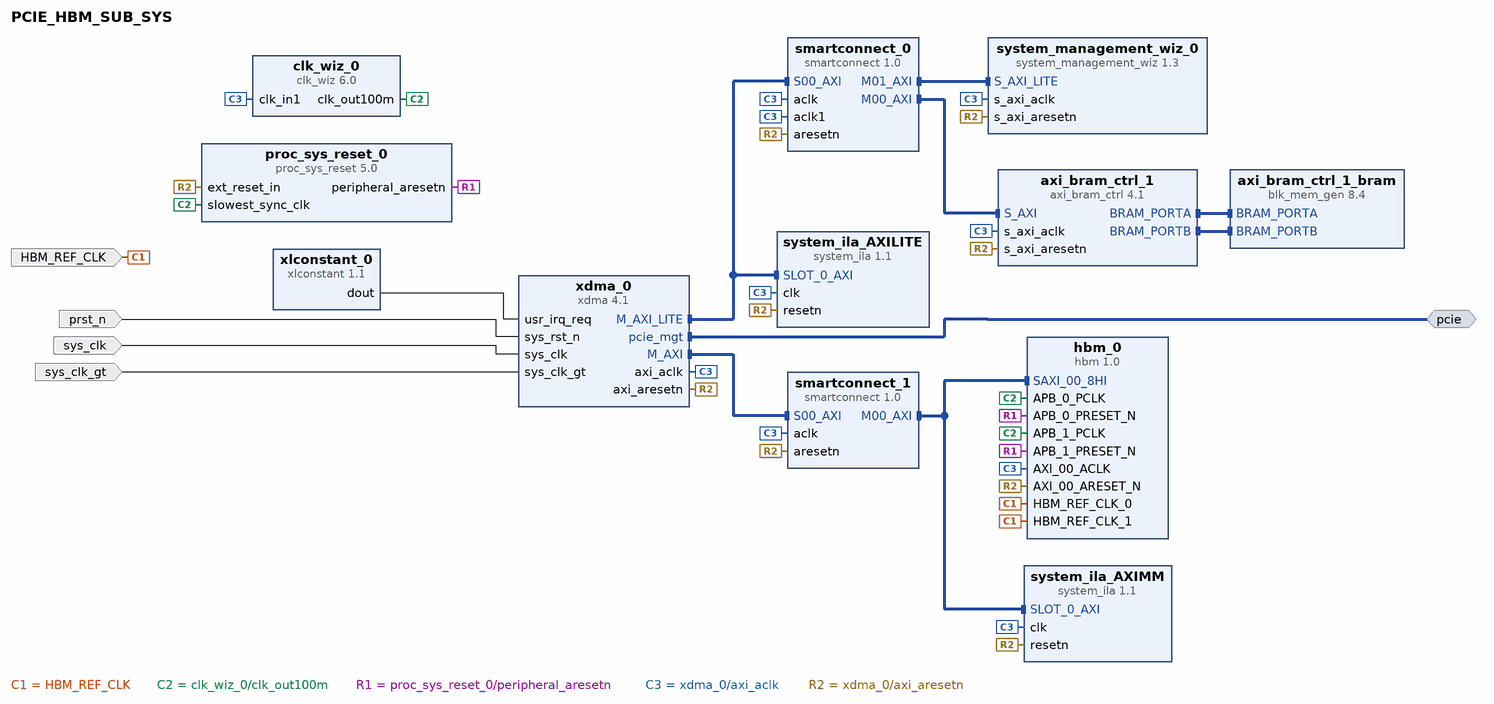
[diagram p0: block diagram of the top level]
# Vivado block design PCIE_HBM_SUB_SYS, xcu55c-fsvh2892-2L-e, Vivado 2021.2
create_bd_design PCIE_HBM_SUB_SYS

create_bd_intf_port -mode Master -vlnv xilinx.com:interface:pcie_7x_mgt_rtl:1.0 pcie
create_bd_port -dir I -type rst prst_n
set_property -dict {CONFIG.POLARITY ACTIVE_LOW} [get_bd_ports prst_n]
create_bd_port -dir I -type clk sys_clk
create_bd_port -dir I -type clk sys_clk_gt
create_bd_port -dir I -type clk HBM_REF_CLK

create_bd_cell -type ip -vlnv xilinx.com:ip:xdma:4.1 xdma_0
set_property -dict [list \
  CONFIG.PF0_DEVICE_ID_mqdma 9048 \
  CONFIG.PF0_SRIOV_VF_DEVICE_ID A048 \
  CONFIG.PF2_DEVICE_ID_mqdma 9248 \
  CONFIG.PF3_DEVICE_ID_mqdma 9348 \
  CONFIG.axi_data_width 512_bit \
  CONFIG.axilite_master_en true \
  CONFIG.axilite_master_size 4 \
  CONFIG.axisten_freq 250 \
  CONFIG.cfg_mgmt_if false \
  CONFIG.mode_selection Advanced \
  CONFIG.pf0_device_id 9048 \
  CONFIG.pl_link_cap_max_link_speed 16.0_GT/s \
  CONFIG.pl_link_cap_max_link_width X8 \
] [get_bd_cells xdma_0]
create_bd_cell -type ip -vlnv xilinx.com:ip:xlconstant:1.1 xlconstant_0
set_property -dict {CONFIG.CONST_VAL 0} [get_bd_cells xlconstant_0]
create_bd_cell -type ip -vlnv xilinx.com:ip:smartconnect:1.0 smartconnect_0
set_property -dict {CONFIG.NUM_CLKS 2 CONFIG.NUM_MI 2 CONFIG.NUM_SI 1} [get_bd_cells smartconnect_0]
create_bd_cell -type ip -vlnv xilinx.com:ip:system_management_wiz:1.3 system_management_wiz_0
set_property -dict {CONFIG.DCLK_FREQUENCY 250.0} [get_bd_cells system_management_wiz_0]
create_bd_cell -type ip -vlnv xilinx.com:ip:axi_bram_ctrl:4.1 axi_bram_ctrl_1
set_property -dict {CONFIG.DATA_WIDTH 512} [get_bd_cells axi_bram_ctrl_1]
create_bd_cell -type ip -vlnv xilinx.com:ip:blk_mem_gen:8.4 axi_bram_ctrl_1_bram
set_property -dict {CONFIG.Memory_Type True_Dual_Port_RAM} [get_bd_cells axi_bram_ctrl_1_bram]
create_bd_cell -type ip -vlnv xilinx.com:ip:system_ila:1.1 system_ila_AXILITE
set_property -dict [list \
  CONFIG.C_INPUT_PIPE_STAGES 1 \
  CONFIG.C_SLOT_0_AXI_R_SEL_TRIG 0 \
  CONFIG.C_SLOT_0_AXI_W_SEL_TRIG 0 \
  CONFIG.C_SLOT_0_TXN_CNTR_EN 0 \
] [get_bd_cells system_ila_AXILITE]
create_bd_cell -type ip -vlnv xilinx.com:ip:system_ila:1.1 system_ila_AXIMM
set_property -dict [list \
  CONFIG.C_INPUT_PIPE_STAGES 1 \
  CONFIG.C_SLOT_0_AXI_R_SEL_TRIG 0 \
  CONFIG.C_SLOT_0_AXI_W_SEL_TRIG 0 \
  CONFIG.C_SLOT_0_TXN_CNTR_EN 0 \
] [get_bd_cells system_ila_AXIMM]
create_bd_cell -type ip -vlnv xilinx.com:ip:hbm:1.0 hbm_0
set_property -dict [list \
  CONFIG.USER_APB_EN false \
  CONFIG.USER_CLK_SEL_LIST0 AXI_00_ACLK \
  CONFIG.USER_CLK_SEL_LIST1 AXI_16_ACLK \
  CONFIG.USER_HBM_CP_1 6 \
  CONFIG.USER_HBM_DENSITY 16GB \
  CONFIG.USER_HBM_FBDIV_1 36 \
  CONFIG.USER_HBM_HEX_CP_RES_1 0x0000A600 \
  CONFIG.USER_HBM_HEX_FBDIV_CLKOUTDIV_1 0x00000902 \
  CONFIG.USER_HBM_HEX_LOCK_FB_REF_DLY_1 0x00001f1f \
  CONFIG.USER_HBM_LOCK_FB_DLY_1 31 \
  CONFIG.USER_HBM_LOCK_REF_DLY_1 31 \
  CONFIG.USER_HBM_RES_1 10 \
  CONFIG.USER_HBM_STACK 2 \
  CONFIG.USER_MC0_BG_INTERLEAVE_EN true \
  CONFIG.USER_MC0_CA0_CA5_MAP 0x1c61440d9 \
  CONFIG.USER_MC0_LADDR_BA0_BA4_MAP 0x00282248 \
  CONFIG.USER_MC0_LADDR_CA0_CA4_MAP 0xc61440d9 \
  CONFIG.USER_MC0_LOOKAHEAD_ACT true \
  CONFIG.USER_MC0_LOOKAHEAD_PCH true \
  CONFIG.USER_MC0_MAINTAIN_COHERENCY true \
  CONFIG.USER_MC0_MANUAL_ADDR_MAP_SEL false \
  CONFIG.USER_MC0_REORDER_EN false \
  CONFIG.USER_MC0_REORDER_QUEUE_EN false \
  CONFIG.USER_MC10_BG_INTERLEAVE_EN true \
  CONFIG.USER_MC10_CA0_CA5_MAP 0x1c61440d9 \
  CONFIG.USER_MC10_LADDR_BA0_BA4_MAP 0x00282248 \
  CONFIG.USER_MC10_LADDR_CA0_CA4_MAP 0xc61440d9 \
  CONFIG.USER_MC10_LOOKAHEAD_ACT true \
  CONFIG.USER_MC10_LOOKAHEAD_PCH true \
  CONFIG.USER_MC10_MAINTAIN_COHERENCY true \
  CONFIG.USER_MC10_REORDER_EN false \
  CONFIG.USER_MC10_REORDER_QUEUE_EN false \
  CONFIG.USER_MC11_BG_INTERLEAVE_EN true \
  CONFIG.USER_MC11_CA0_CA5_MAP 0x1c61440d9 \
  CONFIG.USER_MC11_LADDR_BA0_BA4_MAP 0x00282248 \
  CONFIG.USER_MC11_LADDR_CA0_CA4_MAP 0xc61440d9 \
  CONFIG.USER_MC11_LOOKAHEAD_ACT true \
  CONFIG.USER_MC11_LOOKAHEAD_PCH true \
  CONFIG.USER_MC11_MAINTAIN_COHERENCY true \
  CONFIG.USER_MC11_REORDER_EN false \
  CONFIG.USER_MC11_REORDER_QUEUE_EN false \
  CONFIG.USER_MC12_BG_INTERLEAVE_EN true \
  CONFIG.USER_MC12_CA0_CA5_MAP 0x1c61440d9 \
  CONFIG.USER_MC12_LADDR_BA0_BA4_MAP 0x00282248 \
  CONFIG.USER_MC12_LADDR_CA0_CA4_MAP 0xc61440d9 \
  CONFIG.USER_MC12_LOOKAHEAD_ACT true \
  CONFIG.USER_MC12_LOOKAHEAD_PCH true \
  CONFIG.USER_MC12_MAINTAIN_COHERENCY true \
  CONFIG.USER_MC12_REORDER_EN false \
  CONFIG.USER_MC12_REORDER_QUEUE_EN false \
  CONFIG.USER_MC13_BG_INTERLEAVE_EN true \
  CONFIG.USER_MC13_CA0_CA5_MAP 0x1c61440d9 \
  CONFIG.USER_MC13_LADDR_BA0_BA4_MAP 0x00282248 \
  CONFIG.USER_MC13_LADDR_CA0_CA4_MAP 0xc61440d9 \
  CONFIG.USER_MC13_LOOKAHEAD_ACT true \
  CONFIG.USER_MC13_LOOKAHEAD_PCH true \
  CONFIG.USER_MC13_MAINTAIN_COHERENCY true \
  CONFIG.USER_MC13_REORDER_EN false \
  CONFIG.USER_MC13_REORDER_QUEUE_EN false \
  CONFIG.USER_MC14_BG_INTERLEAVE_EN true \
  CONFIG.USER_MC14_CA0_CA5_MAP 0x1c61440d9 \
  CONFIG.USER_MC14_LADDR_BA0_BA4_MAP 0x00282248 \
  CONFIG.USER_MC14_LADDR_CA0_CA4_MAP 0xc61440d9 \
  CONFIG.USER_MC14_LOOKAHEAD_ACT true \
  CONFIG.USER_MC14_LOOKAHEAD_PCH true \
  CONFIG.USER_MC14_MAINTAIN_COHERENCY true \
  CONFIG.USER_MC14_REORDER_EN false \
  CONFIG.USER_MC14_REORDER_QUEUE_EN false \
  CONFIG.USER_MC15_BG_INTERLEAVE_EN true \
  CONFIG.USER_MC15_CA0_CA5_MAP 0x1c61440d9 \
  CONFIG.USER_MC15_LADDR_BA0_BA4_MAP 0x00282248 \
  CONFIG.USER_MC15_LADDR_CA0_CA4_MAP 0xc61440d9 \
  CONFIG.USER_MC15_LOOKAHEAD_ACT true \
  CONFIG.USER_MC15_LOOKAHEAD_PCH true \
  CONFIG.USER_MC15_MAINTAIN_COHERENCY true \
  CONFIG.USER_MC15_REORDER_EN false \
  CONFIG.USER_MC15_REORDER_QUEUE_EN false \
  CONFIG.USER_MC1_BG_INTERLEAVE_EN true \
  CONFIG.USER_MC1_CA0_CA5_MAP 0x1c61440d9 \
  CONFIG.USER_MC1_LADDR_BA0_BA4_MAP 0x00282248 \
  CONFIG.USER_MC1_LADDR_CA0_CA4_MAP 0xc61440d9 \
  CONFIG.USER_MC1_LOOKAHEAD_ACT true \
  CONFIG.USER_MC1_LOOKAHEAD_PCH true \
  CONFIG.USER_MC1_MAINTAIN_COHERENCY true \
  CONFIG.USER_MC1_REORDER_EN false \
  CONFIG.USER_MC1_REORDER_QUEUE_EN false \
  CONFIG.USER_MC2_BG_INTERLEAVE_EN true \
  CONFIG.USER_MC2_CA0_CA5_MAP 0x1c61440d9 \
  CONFIG.USER_MC2_LADDR_BA0_BA4_MAP 0x00282248 \
  CONFIG.USER_MC2_LADDR_CA0_CA4_MAP 0xc61440d9 \
  CONFIG.USER_MC2_LOOKAHEAD_ACT true \
  CONFIG.USER_MC2_LOOKAHEAD_PCH true \
  CONFIG.USER_MC2_MAINTAIN_COHERENCY true \
  CONFIG.USER_MC2_REORDER_EN false \
  CONFIG.USER_MC2_REORDER_QUEUE_EN false \
  CONFIG.USER_MC3_BG_INTERLEAVE_EN true \
  CONFIG.USER_MC3_CA0_CA5_MAP 0x1c61440d9 \
  CONFIG.USER_MC3_LADDR_BA0_BA4_MAP 0x00282248 \
  CONFIG.USER_MC3_LADDR_CA0_CA4_MAP 0xc61440d9 \
  CONFIG.USER_MC3_LOOKAHEAD_ACT true \
  CONFIG.USER_MC3_LOOKAHEAD_PCH true \
  CONFIG.USER_MC3_MAINTAIN_COHERENCY true \
  CONFIG.USER_MC3_REORDER_EN false \
  CONFIG.USER_MC3_REORDER_QUEUE_EN false \
  CONFIG.USER_MC4_BG_INTERLEAVE_EN true \
  CONFIG.USER_MC4_CA0_CA5_MAP 0x1c61440d9 \
  CONFIG.USER_MC4_LADDR_BA0_BA4_MAP 0x00282248 \
  CONFIG.USER_MC4_LADDR_CA0_CA4_MAP 0xc61440d9 \
  CONFIG.USER_MC4_LOOKAHEAD_ACT true \
  CONFIG.USER_MC4_LOOKAHEAD_PCH true \
  CONFIG.USER_MC4_MAINTAIN_COHERENCY true \
  CONFIG.USER_MC4_REORDER_EN false \
  CONFIG.USER_MC4_REORDER_QUEUE_EN false \
  CONFIG.USER_MC5_BG_INTERLEAVE_EN true \
  CONFIG.USER_MC5_CA0_CA5_MAP 0x1c61440d9 \
  CONFIG.USER_MC5_LADDR_BA0_BA4_MAP 0x00282248 \
  CONFIG.USER_MC5_LADDR_CA0_CA4_MAP 0xc61440d9 \
  CONFIG.USER_MC5_LOOKAHEAD_ACT true \
  CONFIG.USER_MC5_LOOKAHEAD_PCH true \
  CONFIG.USER_MC5_MAINTAIN_COHERENCY true \
  CONFIG.USER_MC5_REORDER_EN false \
  CONFIG.USER_MC5_REORDER_QUEUE_EN false \
  CONFIG.USER_MC6_BG_INTERLEAVE_EN true \
  CONFIG.USER_MC6_CA0_CA5_MAP 0x1c61440d9 \
  CONFIG.USER_MC6_LADDR_BA0_BA4_MAP 0x00282248 \
  CONFIG.USER_MC6_LADDR_CA0_CA4_MAP 0xc61440d9 \
  CONFIG.USER_MC6_LOOKAHEAD_ACT true \
  CONFIG.USER_MC6_LOOKAHEAD_PCH true \
  CONFIG.USER_MC6_MAINTAIN_COHERENCY true \
  CONFIG.USER_MC6_REORDER_EN false \
  CONFIG.USER_MC6_REORDER_QUEUE_EN false \
  CONFIG.USER_MC7_BG_INTERLEAVE_EN true \
  CONFIG.USER_MC7_CA0_CA5_MAP 0x1c61440d9 \
  CONFIG.USER_MC7_LADDR_BA0_BA4_MAP 0x00282248 \
  CONFIG.USER_MC7_LADDR_CA0_CA4_MAP 0xc61440d9 \
  CONFIG.USER_MC7_LOOKAHEAD_ACT true \
  CONFIG.USER_MC7_LOOKAHEAD_PCH true \
  CONFIG.USER_MC7_MAINTAIN_COHERENCY true \
  CONFIG.USER_MC7_REORDER_EN false \
  CONFIG.USER_MC7_REORDER_QUEUE_EN false \
  CONFIG.USER_MC8_BG_INTERLEAVE_EN true \
  CONFIG.USER_MC8_CA0_CA5_MAP 0x1c61440d9 \
  CONFIG.USER_MC8_LADDR_BA0_BA4_MAP 0x00282248 \
  CONFIG.USER_MC8_LADDR_CA0_CA4_MAP 0xc61440d9 \
  CONFIG.USER_MC8_LOOKAHEAD_ACT true \
  CONFIG.USER_MC8_LOOKAHEAD_PCH true \
  CONFIG.USER_MC8_MAINTAIN_COHERENCY true \
  CONFIG.USER_MC8_REORDER_EN false \
  CONFIG.USER_MC8_REORDER_QUEUE_EN false \
  CONFIG.USER_MC9_BG_INTERLEAVE_EN true \
  CONFIG.USER_MC9_CA0_CA5_MAP 0x1c61440d9 \
  CONFIG.USER_MC9_LADDR_BA0_BA4_MAP 0x00282248 \
  CONFIG.USER_MC9_LADDR_CA0_CA4_MAP 0xc61440d9 \
  CONFIG.USER_MC9_LOOKAHEAD_ACT true \
  CONFIG.USER_MC9_LOOKAHEAD_PCH true \
  CONFIG.USER_MC9_MAINTAIN_COHERENCY true \
  CONFIG.USER_MC9_REORDER_EN false \
  CONFIG.USER_MC9_REORDER_QUEUE_EN false \
  CONFIG.USER_MC_ENABLE_08 TRUE \
  CONFIG.USER_MC_ENABLE_09 TRUE \
  CONFIG.USER_MC_ENABLE_10 TRUE \
  CONFIG.USER_MC_ENABLE_11 TRUE \
  CONFIG.USER_MC_ENABLE_12 TRUE \
  CONFIG.USER_MC_ENABLE_13 TRUE \
  CONFIG.USER_MC_ENABLE_14 TRUE \
  CONFIG.USER_MC_ENABLE_15 TRUE \
  CONFIG.USER_MC_ENABLE_APB_01 TRUE \
  CONFIG.USER_PHY_ENABLE_08 TRUE \
  CONFIG.USER_PHY_ENABLE_09 TRUE \
  CONFIG.USER_PHY_ENABLE_10 TRUE \
  CONFIG.USER_PHY_ENABLE_11 TRUE \
  CONFIG.USER_PHY_ENABLE_12 TRUE \
  CONFIG.USER_PHY_ENABLE_13 TRUE \
  CONFIG.USER_PHY_ENABLE_14 TRUE \
  CONFIG.USER_PHY_ENABLE_15 TRUE \
  CONFIG.USER_SAXI_01 false \
  CONFIG.USER_SAXI_02 false \
  CONFIG.USER_SAXI_03 false \
  CONFIG.USER_SAXI_04 false \
  CONFIG.USER_SAXI_05 false \
  CONFIG.USER_SAXI_06 false \
  CONFIG.USER_SAXI_07 false \
  CONFIG.USER_SAXI_08 false \
  CONFIG.USER_SAXI_09 false \
  CONFIG.USER_SAXI_10 false \
  CONFIG.USER_SAXI_11 false \
  CONFIG.USER_SAXI_12 false \
  CONFIG.USER_SAXI_13 false \
  CONFIG.USER_SAXI_14 false \
  CONFIG.USER_SAXI_15 false \
  CONFIG.USER_SAXI_16 false \
  CONFIG.USER_SAXI_17 false \
  CONFIG.USER_SAXI_18 false \
  CONFIG.USER_SAXI_19 false \
  CONFIG.USER_SAXI_20 false \
  CONFIG.USER_SAXI_21 false \
  CONFIG.USER_SAXI_22 false \
  CONFIG.USER_SAXI_23 false \
  CONFIG.USER_SAXI_24 false \
  CONFIG.USER_SAXI_25 false \
  CONFIG.USER_SAXI_26 false \
  CONFIG.USER_SAXI_27 false \
  CONFIG.USER_SAXI_28 false \
  CONFIG.USER_SAXI_29 false \
  CONFIG.USER_SAXI_30 false \
  CONFIG.USER_SAXI_31 false \
  CONFIG.USER_SWITCH_ENABLE_01 TRUE \
  CONFIG.USER_XSDB_INTF_EN FALSE \
] [get_bd_cells hbm_0]
create_bd_cell -type ip -vlnv xilinx.com:ip:smartconnect:1.0 smartconnect_1
set_property -dict {CONFIG.NUM_MI 1 CONFIG.NUM_SI 1} [get_bd_cells smartconnect_1]
create_bd_cell -type ip -vlnv xilinx.com:ip:clk_wiz:6.0 clk_wiz_0
set_property -dict [list \
  CONFIG.CLKOUT1_JITTER 134.506 \
  CONFIG.CLKOUT1_REQUESTED_OUT_FREQ 100.000 \
  CONFIG.CLK_OUT1_PORT clk_out100m \
  CONFIG.MMCM_CLKOUT0_DIVIDE_F 12.000 \
  CONFIG.PRIM_SOURCE No_buffer \
  CONFIG.USE_LOCKED false \
  CONFIG.USE_RESET false \
] [get_bd_cells clk_wiz_0]
create_bd_cell -type ip -vlnv xilinx.com:ip:proc_sys_reset:5.0 proc_sys_reset_0

# ---- connections ----

connect_bd_intf_net [get_bd_intf_pins axi_bram_ctrl_1_bram/BRAM_PORTA] [get_bd_intf_pins axi_bram_ctrl_1/BRAM_PORTA]
connect_bd_intf_net [get_bd_intf_pins axi_bram_ctrl_1_bram/BRAM_PORTB] [get_bd_intf_pins axi_bram_ctrl_1/BRAM_PORTB]
connect_bd_intf_net [get_bd_intf_pins axi_bram_ctrl_1/S_AXI] [get_bd_intf_pins smartconnect_0/M00_AXI]
connect_bd_intf_net [get_bd_intf_pins system_management_wiz_0/S_AXI_LITE] [get_bd_intf_pins smartconnect_0/M01_AXI]
connect_bd_intf_net [get_bd_intf_pins smartconnect_1/M00_AXI] [get_bd_intf_pins hbm_0/SAXI_00_8HI]
connect_bd_intf_net [get_bd_intf_pins smartconnect_1/M00_AXI] [get_bd_intf_pins system_ila_AXIMM/SLOT_0_AXI]
connect_bd_intf_net [get_bd_intf_pins smartconnect_1/S00_AXI] [get_bd_intf_pins xdma_0/M_AXI]
connect_bd_intf_net [get_bd_intf_pins xdma_0/M_AXI_LITE] [get_bd_intf_pins smartconnect_0/S00_AXI]
connect_bd_intf_net [get_bd_intf_pins xdma_0/M_AXI_LITE] [get_bd_intf_pins system_ila_AXILITE/SLOT_0_AXI]
connect_bd_intf_net [get_bd_intf_ports pcie] [get_bd_intf_pins xdma_0/pcie_mgt]
connect_bd_net -net HBM_REF_CLK_0_0_1 [get_bd_ports HBM_REF_CLK] [get_bd_pins hbm_0/HBM_REF_CLK_0] [get_bd_pins hbm_0/HBM_REF_CLK_1]
connect_bd_net [get_bd_pins clk_wiz_0/clk_out100m] \
  [get_bd_pins hbm_0/APB_0_PCLK] [get_bd_pins proc_sys_reset_0/slowest_sync_clk] [get_bd_pins hbm_0/APB_1_PCLK]
connect_bd_net [get_bd_pins proc_sys_reset_0/peripheral_aresetn] [get_bd_pins hbm_0/APB_0_PRESET_N] [get_bd_pins hbm_0/APB_1_PRESET_N]
connect_bd_net -net reset_rtl_0_1 [get_bd_ports prst_n] [get_bd_pins xdma_0/sys_rst_n]
connect_bd_net [get_bd_ports sys_clk] [get_bd_pins xdma_0/sys_clk]
connect_bd_net -net sys_clk_gt_0_1 [get_bd_ports sys_clk_gt] [get_bd_pins xdma_0/sys_clk_gt]
connect_bd_net [get_bd_pins xdma_0/axi_aclk] \
  [get_bd_pins smartconnect_0/aclk1] [get_bd_pins axi_bram_ctrl_1/s_axi_aclk] [get_bd_pins smartconnect_0/aclk] \
  [get_bd_pins system_management_wiz_0/s_axi_aclk] [get_bd_pins system_ila_AXILITE/clk] [get_bd_pins system_ila_AXIMM/clk] \
  [get_bd_pins smartconnect_1/aclk] [get_bd_pins hbm_0/AXI_00_ACLK] [get_bd_pins clk_wiz_0/clk_in1]
connect_bd_net [get_bd_pins xdma_0/axi_aresetn] \
  [get_bd_pins axi_bram_ctrl_1/s_axi_aresetn] [get_bd_pins system_management_wiz_0/s_axi_aresetn] \
  [get_bd_pins smartconnect_0/aresetn] [get_bd_pins system_ila_AXILITE/resetn] [get_bd_pins system_ila_AXIMM/resetn] \
  [get_bd_pins smartconnect_1/aresetn] [get_bd_pins hbm_0/AXI_00_ARESET_N] [get_bd_pins proc_sys_reset_0/ext_reset_in]
connect_bd_net [get_bd_pins xlconstant_0/dout] [get_bd_pins xdma_0/usr_irq_req]

# ---- address map ----
assign_bd_address -offset 0x0000000000000000 -range 512M -target_address_space [get_bd_addr_spaces xdma_0/M_AXI] [get_bd_addr_segs hbm_0/SAXI_00_8HI/HBM_MEM00]
assign_bd_address -offset 0x0000000020000000 -range 512M -target_address_space [get_bd_addr_spaces xdma_0/M_AXI] [get_bd_addr_segs hbm_0/SAXI_00_8HI/HBM_MEM01]
assign_bd_address -offset 0x0000000040000000 -range 512M -target_address_space [get_bd_addr_spaces xdma_0/M_AXI] [get_bd_addr_segs hbm_0/SAXI_00_8HI/HBM_MEM02]
assign_bd_address -offset 0x0000000060000000 -range 512M -target_address_space [get_bd_addr_spaces xdma_0/M_AXI] [get_bd_addr_segs hbm_0/SAXI_00_8HI/HBM_MEM03]
assign_bd_address -offset 0x0000000080000000 -range 512M -target_address_space [get_bd_addr_spaces xdma_0/M_AXI] [get_bd_addr_segs hbm_0/SAXI_00_8HI/HBM_MEM04]
assign_bd_address -offset 0x00000000A0000000 -range 512M -target_address_space [get_bd_addr_spaces xdma_0/M_AXI] [get_bd_addr_segs hbm_0/SAXI_00_8HI/HBM_MEM05]
assign_bd_address -offset 0x00000000C0000000 -range 512M -target_address_space [get_bd_addr_spaces xdma_0/M_AXI] [get_bd_addr_segs hbm_0/SAXI_00_8HI/HBM_MEM06]
assign_bd_address -offset 0x00000000E0000000 -range 512M -target_address_space [get_bd_addr_spaces xdma_0/M_AXI] [get_bd_addr_segs hbm_0/SAXI_00_8HI/HBM_MEM07]
assign_bd_address -offset 0x0000000100000000 -range 512M -target_address_space [get_bd_addr_spaces xdma_0/M_AXI] [get_bd_addr_segs hbm_0/SAXI_00_8HI/HBM_MEM08]
assign_bd_address -offset 0x0000000120000000 -range 512M -target_address_space [get_bd_addr_spaces xdma_0/M_AXI] [get_bd_addr_segs hbm_0/SAXI_00_8HI/HBM_MEM09]
assign_bd_address -offset 0x0000000140000000 -range 512M -target_address_space [get_bd_addr_spaces xdma_0/M_AXI] [get_bd_addr_segs hbm_0/SAXI_00_8HI/HBM_MEM10]
assign_bd_address -offset 0x0000000160000000 -range 512M -target_address_space [get_bd_addr_spaces xdma_0/M_AXI] [get_bd_addr_segs hbm_0/SAXI_00_8HI/HBM_MEM11]
assign_bd_address -offset 0x0000000180000000 -range 512M -target_address_space [get_bd_addr_spaces xdma_0/M_AXI] [get_bd_addr_segs hbm_0/SAXI_00_8HI/HBM_MEM12]
assign_bd_address -offset 0x00000001A0000000 -range 512M -target_address_space [get_bd_addr_spaces xdma_0/M_AXI] [get_bd_addr_segs hbm_0/SAXI_00_8HI/HBM_MEM13]
assign_bd_address -offset 0x00000001C0000000 -range 512M -target_address_space [get_bd_addr_spaces xdma_0/M_AXI] [get_bd_addr_segs hbm_0/SAXI_00_8HI/HBM_MEM14]
assign_bd_address -offset 0x00000001E0000000 -range 512M -target_address_space [get_bd_addr_spaces xdma_0/M_AXI] [get_bd_addr_segs hbm_0/SAXI_00_8HI/HBM_MEM15]
assign_bd_address -offset 0x0000000200000000 -range 512M -target_address_space [get_bd_addr_spaces xdma_0/M_AXI] [get_bd_addr_segs hbm_0/SAXI_00_8HI/HBM_MEM16]
assign_bd_address -offset 0x0000000220000000 -range 512M -target_address_space [get_bd_addr_spaces xdma_0/M_AXI] [get_bd_addr_segs hbm_0/SAXI_00_8HI/HBM_MEM17]
assign_bd_address -offset 0x0000000240000000 -range 512M -target_address_space [get_bd_addr_spaces xdma_0/M_AXI] [get_bd_addr_segs hbm_0/SAXI_00_8HI/HBM_MEM18]
assign_bd_address -offset 0x0000000260000000 -range 512M -target_address_space [get_bd_addr_spaces xdma_0/M_AXI] [get_bd_addr_segs hbm_0/SAXI_00_8HI/HBM_MEM19]
assign_bd_address -offset 0x0000000280000000 -range 512M -target_address_space [get_bd_addr_spaces xdma_0/M_AXI] [get_bd_addr_segs hbm_0/SAXI_00_8HI/HBM_MEM20]
assign_bd_address -offset 0x00000002A0000000 -range 512M -target_address_space [get_bd_addr_spaces xdma_0/M_AXI] [get_bd_addr_segs hbm_0/SAXI_00_8HI/HBM_MEM21]
assign_bd_address -offset 0x00000002C0000000 -range 512M -target_address_space [get_bd_addr_spaces xdma_0/M_AXI] [get_bd_addr_segs hbm_0/SAXI_00_8HI/HBM_MEM22]
assign_bd_address -offset 0x00000002E0000000 -range 512M -target_address_space [get_bd_addr_spaces xdma_0/M_AXI] [get_bd_addr_segs hbm_0/SAXI_00_8HI/HBM_MEM23]
assign_bd_address -offset 0x0000000300000000 -range 512M -target_address_space [get_bd_addr_spaces xdma_0/M_AXI] [get_bd_addr_segs hbm_0/SAXI_00_8HI/HBM_MEM24]
assign_bd_address -offset 0x0000000320000000 -range 512M -target_address_space [get_bd_addr_spaces xdma_0/M_AXI] [get_bd_addr_segs hbm_0/SAXI_00_8HI/HBM_MEM25]
assign_bd_address -offset 0x0000000340000000 -range 512M -target_address_space [get_bd_addr_spaces xdma_0/M_AXI] [get_bd_addr_segs hbm_0/SAXI_00_8HI/HBM_MEM26]
assign_bd_address -offset 0x0000000360000000 -range 512M -target_address_space [get_bd_addr_spaces xdma_0/M_AXI] [get_bd_addr_segs hbm_0/SAXI_00_8HI/HBM_MEM27]
assign_bd_address -offset 0x0000000380000000 -range 512M -target_address_space [get_bd_addr_spaces xdma_0/M_AXI] [get_bd_addr_segs hbm_0/SAXI_00_8HI/HBM_MEM28]
assign_bd_address -offset 0x00000003A0000000 -range 512M -target_address_space [get_bd_addr_spaces xdma_0/M_AXI] [get_bd_addr_segs hbm_0/SAXI_00_8HI/HBM_MEM29]
assign_bd_address -offset 0x00000003C0000000 -range 512M -target_address_space [get_bd_addr_spaces xdma_0/M_AXI] [get_bd_addr_segs hbm_0/SAXI_00_8HI/HBM_MEM30]
assign_bd_address -offset 0x00000003E0000000 -range 512M -target_address_space [get_bd_addr_spaces xdma_0/M_AXI] [get_bd_addr_segs hbm_0/SAXI_00_8HI/HBM_MEM31]
assign_bd_address -offset 0x00000000 -range 8K -target_address_space [get_bd_addr_spaces xdma_0/M_AXI_LITE] [get_bd_addr_segs axi_bram_ctrl_1/S_AXI/Mem0]
assign_bd_address -offset 0x00020000 -range 64K -target_address_space [get_bd_addr_spaces xdma_0/M_AXI_LITE] [get_bd_addr_segs system_management_wiz_0/S_AXI_LITE/Reg]

validate_bd_design
save_bd_design
